# Altium schematic sheet SAMD20_Xplained_Pro_SWD_LVS.SchDoc: External Programming
size A3; Organization: ATMEL Norway; Address1: Vestre Rosten 79; Address2: N-7075 TILLER; Address3: NORWAY; DocumentNumber: A09-1873; Revision: 6; SheetNumber: 6; SheetTotal: 6; PageSetup: Record=PageOptions|CenterHorizontal=True|CenterVertical=True|PrintScale=1.01|XCorrection=1.00|YCorrection=1.00|PrintKind=1|BorderSize=5000000|LeftOffset=0|BottomOffset=0|Orientation=2|PaperLength=1000|PaperWidth=1000|Scale=100|PaperSource=7|PrintQuality=-4|MediaType=1|DitherType=10|PaperKind=A3 (297 x 420 mm)|PrintScaleMode=1
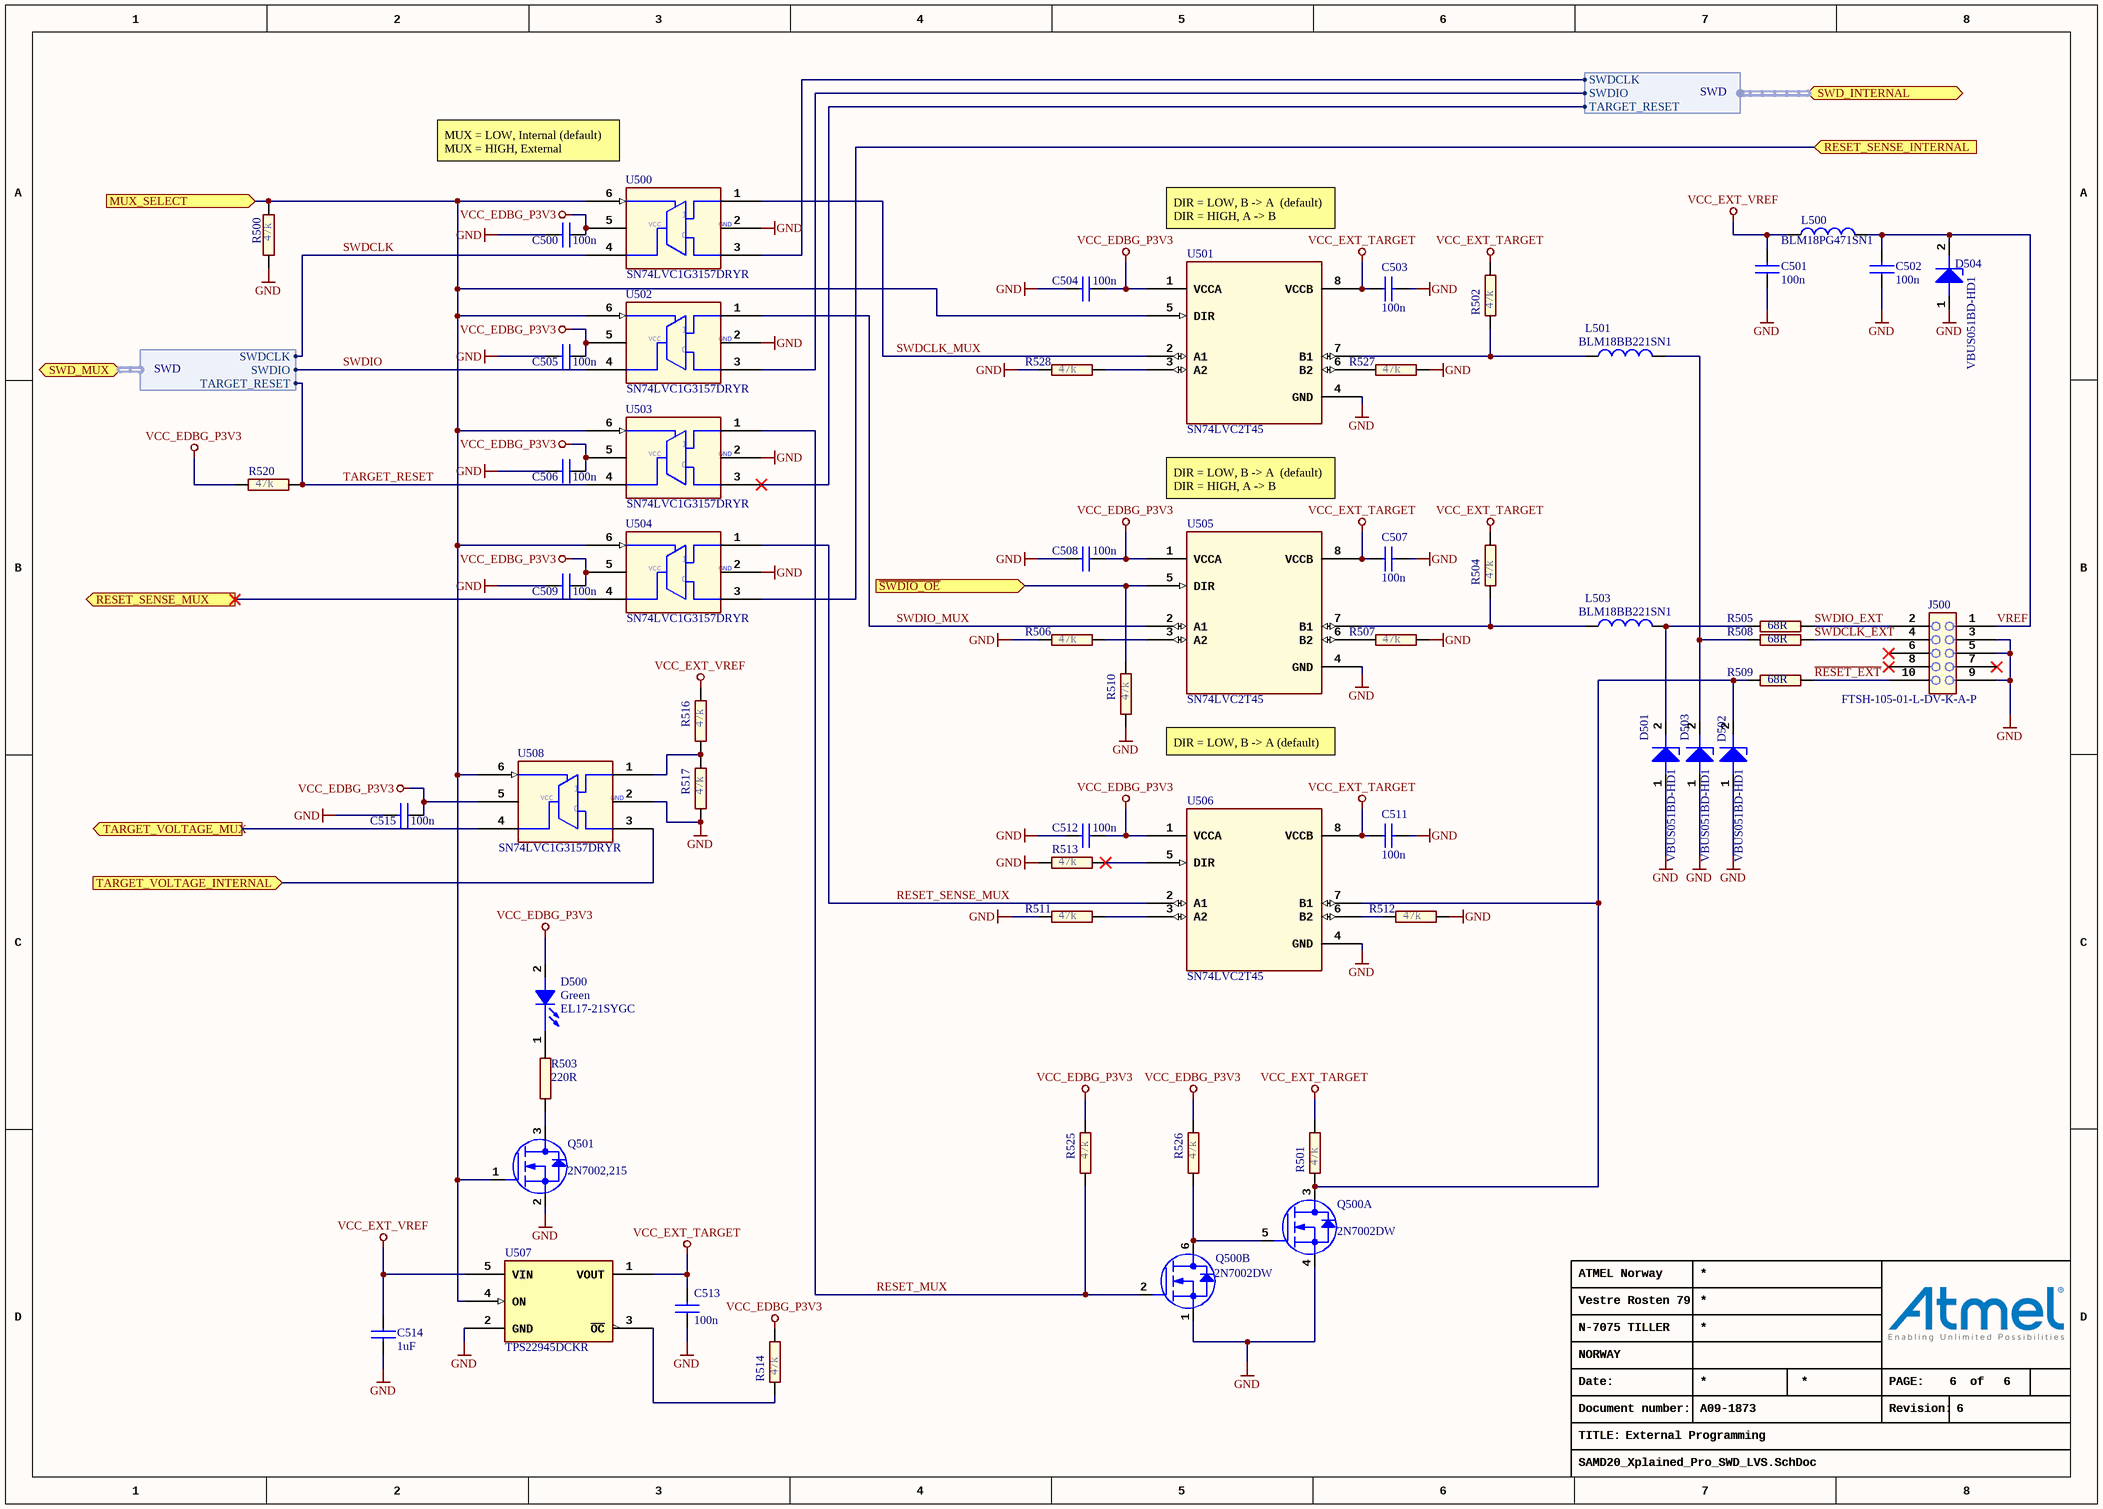
[diagram p0: SAMD20_Xplained_Pro_SWD_LVS.SchDoc]

## Parts
C500  value 100n  [AP1-00001]  (hidden comment: CAP-NONPOL)
C501  value 100n  [AP1-00001]  (hidden comment: CAP-NONPOL)
C502  value 100n  [AP1-00001]  (hidden comment: CAP-NONPOL)
C503  value 100n  [AP1-00001]  (hidden comment: CAP-NONPOL)
C504  value 100n  [AP1-00001]  (hidden comment: CAP-NONPOL)
C505  value 100n  [AP1-00001]  (hidden comment: CAP-NONPOL)
C506  value 100n  [AP1-00001]  (hidden comment: CAP-NONPOL)
C507  value 100n  [AP1-00001]  (hidden comment: CAP-NONPOL)
C508  value 100n  [AP1-00001]  (hidden comment: CAP-NONPOL)
C509  value 100n  [AP1-00001]  (hidden comment: CAP-NONPOL)
C511  value 100n  [AP1-00001]  (hidden comment: CAP-NONPOL)
C512  value 100n  [AP1-00001]  (hidden comment: CAP-NONPOL)
C513  value 100n  [AP1-00001]  (hidden comment: CAP-NONPOL)
C514  value 1uF  [AP1-00002]  (hidden comment: CAP-NONPOL)
C515  value 100n  [AP1-00001]  (hidden comment: CAP-NONPOL)
D500  Green  value EL17-21SYGC  [AP4-00013]
D501  value VBUS051BD-HD1  [AP4-00048]  (hidden comment: ESD_DIODE_21)
D502  value VBUS051BD-HD1  [AP4-00048]  (hidden comment: ESD_DIODE_21)
D503  value VBUS051BD-HD1  [AP4-00048]  (hidden comment: ESD_DIODE_21)
D504  value VBUS051BD-HD1  [AP4-00048]  (hidden comment: ESD_DIODE_21)
J500  value FTSH-105-01-L-DV-K-A-P  [AP8-00689]  (hidden comment: Changed footprint w/guide)
L500  value BLM18PG471SN1  [AP3-00005]  (hidden comment: INDUCTOR)
L501  value BLM18BB221SN1  [AP3-00005]  (hidden comment: INDUCTOR)
L503  value BLM18BB221SN1  [AP3-00005]  (hidden comment: INDUCTOR)
Q500  value 2N7002DW  [AP5-00001]  (hidden comment: Same as 2N7002 but with two MOSFETs in one package)  (parts A,B of 2)
Q501  value 2N7002,215  [AP5-00002]  (hidden comment: MOSFET_N_GSD)
R500  value 47k  [AP2-00000]  (hidden comment: R2)
R501  value 47k  [AP2-00000]  (hidden comment: R2)
R502  value 47k  [AP2-00000]  (hidden comment: R2)
R503  value 220R  [AP2-00000]  (hidden comment: R2)
R504  value 47k  [AP2-00000]  (hidden comment: R2)
R505  value 68R  [AP2-00000]  (hidden comment: R2)
R506  value 47k  [AP2-00000]  (hidden comment: R2)
R507  value 47k  [AP2-00000]  (hidden comment: R2)
R508  value 68R  [AP2-00000]  (hidden comment: R2)
R509  value 68R  [AP2-00000]  (hidden comment: R2)
R510  value 47k  [AP2-00000]  (hidden comment: R2)
R511  value 47k  [AP2-00000]  (hidden comment: R2)
R512  value 47k  [AP2-00000]  (hidden comment: R2)
R513  value 47k  [AP2-00000]  (hidden comment: R2)
R514  value 47k  [AP2-00000]  (hidden comment: R2)
R516  value 47k  [AP2-00000]  (hidden comment: R2)
R517  value 47k  [AP2-00000]  (hidden comment: R2)
R520  value 47k  [AP2-00000]  (hidden comment: R2)
R525  value 47k  [AP2-00000]  (hidden comment: R2)
R526  value 47k  [AP2-00000]  (hidden comment: R2)
R527  value 47k  [AP2-00000]  (hidden comment: R2)
R528  value 47k  [AP2-00000]  (hidden comment: R2)
U500  value SN74LVC1G3157DRYR  [AP6-00076]  (hidden comment: FSA3157)
U501  SN74LVC2T45  [AP6-00102]
U502  value SN74LVC1G3157DRYR  [AP6-00076]  (hidden comment: FSA3157)
U503  value SN74LVC1G3157DRYR  [AP6-00076]  (hidden comment: FSA3157)
U504  value SN74LVC1G3157DRYR  [AP6-00076]  (hidden comment: FSA3157)
U505  SN74LVC2T45  [AP6-00102]
U506  SN74LVC2T45  [AP6-00102]
U507  value TPS22945DCKR  [AP6-00012]  (hidden comment: TPS2294x)
U508  value SN74LVC1G3157DRYR  [AP6-00076]  (hidden comment: FSA3157)

## Ports
MUX_SELECT (in), RESET_SENSE_INTERNAL (in), RESET_SENSE_MUX (out), SWD_INTERNAL (harness SWD), SWD_MUX (harness SWD), TARGET_VOLTAGE_INTERNAL (in), TARGET_VOLTAGE_MUX (out), ~{SWDIO_OE} (in)

## Harnesses
SWD: SWDCLK, SWDIO, TARGET_RESET

## Nets
GND: C500.2 C501.1 C502.1 C503.2 C504.2 C505.2 C506.2 C507.2 C508.2 C509.2 C511.2 C512.2 C513.1 C514.2 C515.2 D501.1 D502.1 D503.1 D504.1 J500.3 J500.5 J500.9 Q500.1(S2) Q500.4(S1) Q501.2(S) R500.2 R506.2 R507.2 R510.1 R511.2 R512.2 R513.1 R517.1 R527.2 R528.2 U500.2(GND) U501.4(GND) U502.2(GND) U503.2(GND) U504.2(GND) U505.4(GND) U506.4(GND) U507.2(GND) U508.2(GND)
VCC_EDBG_P3V3: C500.1 C504.1 C505.1 C506.1 C508.1 C509.1 C512.1 C515.1 D500.2(ANODE) R514.2 R520.2 R525.2 R526.2 U500.5(VCC) U501.1(VCCA) U502.5(VCC) U503.5(VCC) U504.5(VCC) U505.1(VCCA) U506.1(VCCA) U508.5(VCC)
VCC_EXT_TARGET: C503.1 C507.1 C511.1 C513.2 R501.2 R502.1 R504.2 U501.8(VCCB) U505.8(VCCB) U506.8(VCCB) U507.1(VOUT)
VCC_EXT_VREF: C501.2 C514.1 L500.1 R516.2 U507.5(VIN)
MUX_SELECT: Q501.1(G) R500.1 U500.6(EN) U501.5(DIR) U502.6(EN) U503.6(EN) U504.6(EN) U507.4(ON) U508.6(EN) ; port MUX_SELECT
~{RESET_EXT}: J500.10 R509.2
RESET_MUX: Q500.2(G2) R525.1 U503.1(B1)
RESET_SENSE_INTERNAL: U504.3(B0) ; port RESET_SENSE_INTERNAL
RESET_SENSE_MUX: U504.1(B1) U506.2(A1)
RESET_SENSE_MUX: U504.4(A) ; port RESET_SENSE_MUX  [a separate net that carries the same name]
~{SWDIO_OE}: R510.2 U505.5(DIR) ; port ~{SWDIO_OE}
SWDCLK: U500.4(A) ; port SWD_MUX.SWDCLK
SWDCLK_EXT: J500.4 R508.2
SWDCLK_MUX: U500.1(B1) U501.2(A1)
SWDIO: U502.4(A) ; port SWD_MUX.SWDIO
SWDIO_EXT: J500.2 R505.2
SWDIO_MUX: U502.1(B1) U505.2(A1)
TARGET_RESET: R520.1 U503.4(A) ; port SWD_MUX.TARGET_RESET
TARGET_VOLTAGE_INTERNAL: U508.3(B0) ; port TARGET_VOLTAGE_INTERNAL
TARGET_VOLTAGE_MUX: U508.4(A) ; port TARGET_VOLTAGE_MUX
VREF: C502.2 D504.2 J500.1 L500.2
NetD500_1: D500.1(CATHODE) R503.2
NetD501_2: D501.2 L503.2 R505.1
NetD502_2: D502.2 Q500.3(D1) R501.1 R509.1 U506.7(B1)
NetD503_2: D503.2 L501.2 R508.1
NetL501_1: L501.1 R502.2 U501.7(B1)
NetL503_1: L503.1 R504.1 U505.7(B1)
NetQ500_5: Q500.5(G1) Q500.6(D2) R526.1
NetQ501_3: Q501.3(D) R503.1
NetR506_1: R506.1 U505.3(A2)
NetR507_1: R507.1 U505.6(B2)
NetR511_1: R511.1 U506.3(A2)
NetR512_1: R512.1 U506.6(B2)
NetR513_2: R513.2 U506.5(DIR)
NetR514_1: R514.1 U507.3(~{OC})
NetR516_1: R516.1 R517.2 U508.1(B1)
NetR527_1: R527.1 U501.6(B2)
NetR528_1: R528.1 U501.3(A2)
NetU500_3: U500.3(B0) ; port SWD_INTERNAL.SWDCLK
NetU502_3: U502.3(B0) ; port SWD_INTERNAL.SWDIO
NetU503_3: U503.3(B0) ; port SWD_INTERNAL.TARGET_RESET

Not connected (* = marked no-connect by the designer): J500 6* 7* 8*

## Notes on the sheet
- (near U500) MUX = LOW, Internal (default)
  MUX = HIGH, External
- DIR = LOW, B -> A  (default)
  DIR = HIGH, A -> B
- DIR = LOW, B -> A (default)
- Date:
- PAGE:
- of
- TITLE:
- Document number:
- Revision:
- (in symbol A06-0765) 0

## Library data of the parts
C500-C509 C511-C513 C515 = A01-0246: Ceramic capacitor, SMD 0402, X7R, 16V, +/-10%; PartGroup: Capacitors,Ceramic,SMD 0402; Manufacturer: Kemet; MPN: C0402C104K4RACTU; TemperatureRange: -55 - +125 deg C; AN: A01-0246; Tolerance: 16V, +/-10%; Height: 0.5
C514 = A01-0368: Ceramic capacitor, SMD 0603, X5R, 25V, ±10%; PartGroup: Capacitors,Ceramic,SMD 0603; Manufacturer: Murata; MPN: GRM188R61E105K; AN: A01-0368; Tolerance: ±10%; Height: 0.800000011920929
D500 = A10-0018: LED, Green, Wave length=575nm, SMD 0805, ±70°; PartGroup: Opto,LEDs,SMD; Manufacturer: Everlight; TemperatureRange: -40 - +85 deg C; AN: A10-0018; Height: 1,10000002384186; MPN: EL17-21SYGC
D501-D504 = A04-0057: Low capacitence ESD-Protection Diode in LLP1006-2L; PartGroup: Diodes,Transient suppression; Manufacturer: vishay; TemperatureRange: -40 deg C to +125 deg C; AN: A04-0057; Height: 0.400000005960464; MPN: VBUS051BD-HD1
J500 = A08-0729: SAMTEC FTSH series 50-mil micro header (vertical); PartGroup: Mechanical devices,Connectors,Pin headers; AN: A08-0729; Height: 5.96999979019165; Manufacturer: SAMTEC; MPN: FTSH-105-01-L-DV-K-A-P
L500 = A03-0035: SMD RF inductor 0603. Z=470Ohm (@100MHz), Max R(dc)=0.65Ohm, Max current=1A; PartGroup: Inductors,EMI; Manufacturer: Murata; Tolerance: ±25%; TemperatureRange: -55°C to +125°C; AN: A03-0035; Height: 0.800000011920929; MPN: BLM18PG471SN1
L501 L503 = A03-0034: SMD RF inductor 0603. Z=220Ohm (@100MHz), Max R(dc)=0.65Ohm, Max current=200mA; PartGroup: Inductors,EMI; Manufacturer: Murata; Tolerance: ±25%; TemperatureRange: -55°C to +125°C; AN: A03-0034; Height: 0.800000011920929; MPN: BLM18BB221SN1
Q500 = A05-0051: Dual N-Channel MOSFET, 60V, 115mA cont,RDS(ON) < 7.5 Ohm @50mA@5V, SOT-363; PartGroup: Transistors,Small signal FET,SMD; Manufacturer: Fairchild; TemperatureRange: -65 to 150 deg C; AN: A05-0051; Height: 1.10000002384186; MPN: 2N7002DW
Q501 = A05-0085: N-Channel MOSFET. 60V, 0.300A continuous, 1.2A Peak. RDS(ON) = 3.8Ohm@VGS=4.5V, VGS(th)<2.5V; PartGroup: Transistors,Small signal FET,SMD; Manufacturer: NXP; TemperatureRange: -65 to 150 deg C; AN: A05-0085; Height: 1.10000002384186; MPN: 2N7002,215
R500-R502 R504 R506 R507 R510-R514 R516 R517 R520 R525-R528 = A02-0252: Thick film resistor, SMD 0402, 1/16W, 1%; PartGroup: Resistors,SMD,0402 1%; TemperatureRange: -55 - +125 deg C; AN: A02-0252; Tolerance: 1 %; Height: 0.349999994039536
R503 = A02-0196: Thick film resistor, SMD 0402, 1/16W, 1%; PartGroup: Resistors,SMD,0402 1%; TemperatureRange: -55 - +125 deg C; AN: A02-0196; Tolerance: 1 %; Height: 0,349999994039536
R505 R508 R509 = A02-0184: Thick film resistor, SMD 0402, 1/16W, 1%; PartGroup: Resistors,SMD,0402 1%; TemperatureRange: -55 - +125 deg C; AN: A02-0184; Tolerance: 1 %; Height: 0.349999994039536
U500 U502-U504 U508 = A06-0765: SPDT analog switch or 2:1 multiplexer; PartGroup: Integrated Circuits,General linear,Analog switch, bus switch and MUX; Manufacturer: Texas Instruments; TemperatureRange: -40 - +85 deg C; AN: A06-0765; Height: 0.600000023841858; MPN: SN74LVC1G3157DRYR
U501 U505 U506 = A06-0085: Dual Voltage Level Translator SN74LVC2T45; PartGroup: Integrated Circuits,Interface ICs,Level translators; Manufacturer: Texas Instruments; Value: SN74LVC2T45DCURG4; TemperatureRange: -40C - +85C; AN: A06-0085; Height: 0.899999976158142; MPN: SN74LVC2T45DCURG4
U507 = A06-0392: LOW-INPUT-VOLTAGE CURRENT-LIMITED LOAD SWITCH; PartGroup: Integrated Circuits,General linear,Analog switch, bus switch and MUX; Manufacturer: Texas Instruments; TemperatureRange: -40 deg C to +85 deg C; AN: A06-0392; Height: 1.10000002384186; MPN: TPS22945DCKR